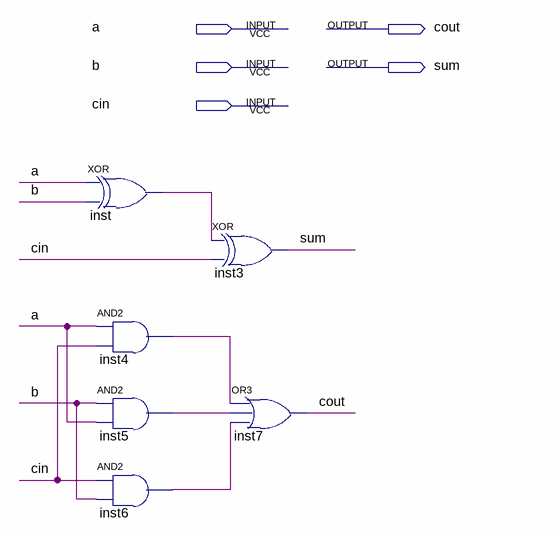
[diagram p0: schematic sheet]
// Quartus schematic lab1.bdf as structural Verilog: 6 symbols, 5 pins
module lab1 (
  input  a,
  input  b,
  input  cin,
  output cout,
  output sum
);

  wire inst4_out, inst5_out, inst6_out, inst_out;

  xor inst (inst_out, a, b);
  and inst4 (inst4_out, a, cin);
  and inst5 (inst5_out, b, a);
  and inst6 (inst6_out, cin, b);
  xor inst3 (sum, inst_out, cin);
  or inst7 (cout, inst4_out, inst5_out, inst6_out);
endmodule
